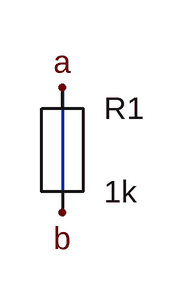
[diagram p0: schematic same_instance_wire.asc]
same_instance_wire.asc, the LTspice schematic file:
Version 4
SHEET 1 880 680
WIRE 96 96 96 192
SYMBOL res 96 144 R0
SYMATTR InstName R1
SYMATTR Value 1k
FLAG 96 96 a
FLAG 96 192 b

The netlist it stands for:
* same_instance_wire.asc
R1 b b 1k
.backanno
.end